# Altium schematic sheet MAZ000154 - Diagrama eléctrico.SchDoc: MAZ000154 - Diagrama eléctrico
size A; ApprovedBy: Christian Ledwidth; CheckedBy: Nahuel Martinez; Author: Santiago Marti; CompanyName: Body Health; DrawnBy: Santiago Marti; Revision: A; SheetNumber: 1; SheetTotal: 2
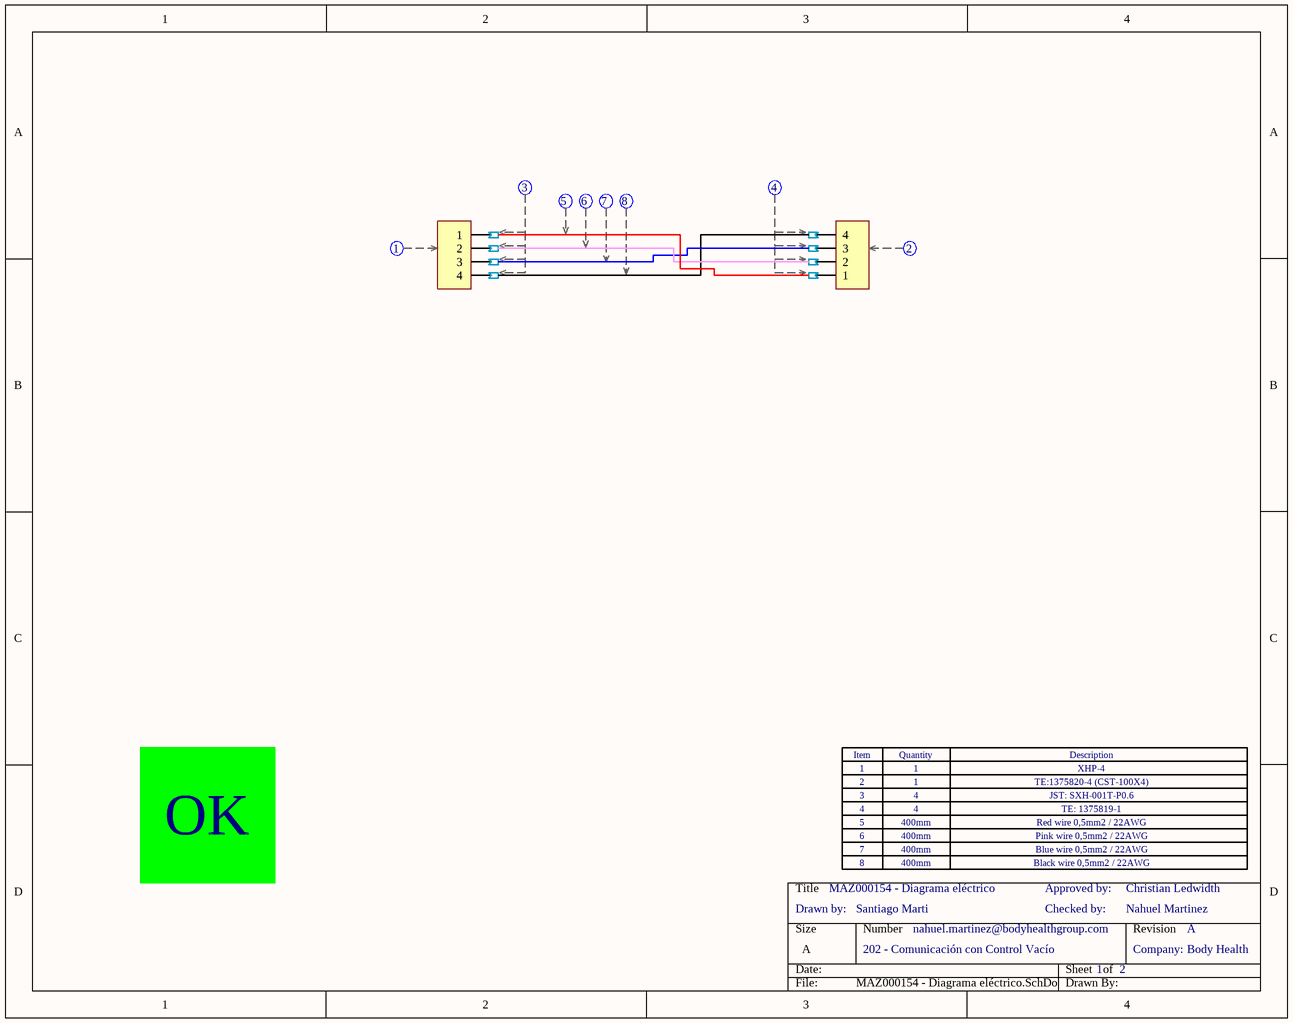
[diagram p0: MAZ000154 - Diagrama eléctrico.SchDoc]

## Parts
(Parts that share a designator on the sheet are numbered #1, #2 ... from top to bottom, then left to right.)
Cab?#1  Cable  (value not drawn)
Cab?#2  Cable  (value not drawn)
Cab?#3  Cable  (value not drawn)
Cab?#4  Cable  (value not drawn)
Con?#1  CST-100-4  (value not drawn)  (part D of 4)
Con?#2  XHP-4  (value not drawn)  (part C of 4)
Con?#3  CST-100-4  (value not drawn)  (part C of 4)
Con?#4  XHP-4  (value not drawn)  (part D of 4)
Soc?#1  sock_XHP_SXH-002T-P0.6  (value not drawn)  (part A of 2)
Soc?#2  sock_CST_1375819-1  (value not drawn)  (part A of 2)
Soc?#3  sock_XHP_SXH-002T-P0.6  (value not drawn)  (part B of 2)
Soc?#4  sock_CST_1375819-1  (value not drawn)  (part B of 2)
Soc?#5  sock_XHP_SXH-002T-P0.6  (value not drawn)  (part B of 2)
Soc?#6  sock_CST_1375819-1  (value not drawn)  (part B of 2)
Soc?#7  sock_XHP_SXH-002T-P0.6  (value not drawn)  (part B of 2)
Soc?#8  sock_CST_1375819-1  (value not drawn)  (part B of 2)
Soc?#9  sock_XHP_SXH-002T-P0.6  (value not drawn)  (part B of 2)
Soc?#10  sock_CST_1375819-1  (value not drawn)  (part B of 2)
Zoc1  Zócalo_Header  (value not drawn)
Zoc2  Zócalo_Item  (value not drawn)
Zoc3  Zócalo_Item  (value not drawn)
Zoc4  Zócalo_Item  (value not drawn)
Zoc5  Zócalo_Item  (value not drawn)
Zoc6  Zócalo_Item  (value not drawn)
Zoc7  Zócalo_Item  (value not drawn)
Zoc8  Zócalo_Item  (value not drawn)
Zoc9  Zócalo_Item  (value not drawn)

## Nets
NetCon?#1_1: Con?#1.1 Soc?#10.0
NetCon?#1_2: Con?#1.2 Soc?#8.0
NetCon?#1_3: Con?#1.3 Soc?#6.0
NetCon?#1_4: Con?#1.4 Soc?#4.0
NetCon?#4_1: Con?#4.1 Soc?#3.0
NetCon?#4_2: Con?#4.2 Soc?#5.0
NetCon?#4_3: Con?#4.3 Soc?#7.0
NetCon?#4_4: Con?#4.4 Soc?#9.0
NetSoc?#3_1: Soc?#3.1 Soc?#10.1
NetSoc?#4_1: Soc?#4.1 Soc?#9.1
NetSoc?#5_1: Soc?#5.1 Soc?#8.1
NetSoc?#6_1: Soc?#6.1 Soc?#7.1

## Notes on the sheet
- 1
- 2
- XHP-4
- TE:1375820-4 (CST-100X4)
- OK
- 3
- 4
- 5
- 6
- 400mm
- JST: SXH-001T-P0.6
- TE: 1375819-1
- Red wire 0,5mm2 / 22AWG
- Pink wire 0,5mm2 / 22AWG
- Drawn by:
- 7
- 8
- Checked by:
- Approved by:
- Blue wire 0,5mm2 / 22AWG
- Black wire 0,5mm2 / 22AWG
- 202 - Comunicación con Control Vacío
- nahuel.martinez@bodyhealthgroup.com
- Company:
- (in symbol Zócalo_Header) Item; Quantity; Description

## Library data of the parts
Cab?#1 = Cable: CallOut: 5; Largo: *mm; Sección: 0,5mm2; Color: Red
Cab?#2 = Cable: CallOut: 6; Largo: *mm; Sección: 0,5mm2; Color: Pink
Cab?#3 = Cable: CallOut: 7; Largo: *mm; Sección: 0,5mm2; Color: Blue
Cab?#4 = Cable: CallOut: 8; Largo: *mm; Sección: 0,5mm2; Color: Black
Con?#1 = CST-100-4: CONN RCPT HSNG 4POS CST-100 II; Cod.Fabricante: 1375820-4; Fabricante: TE Connectivity AMP Connectors; Cod.DigiKey: A99615-ND; ComponentLink1Description: Manufacturer Link; ComponentLink1URL: https://www.te.com/commerce/DocumentDelivery/DDEController?Action=srchrtrv&DocNm=1375820&DocType=Customer+Drawing&DocLang=English; DIGIKEYx50: 0.18440; CallOut: *; DIGIKEYx100: 0.17120
Con?#2 = XHP-4: CONN HOUSING 2.5MM 4POS; Fabricante: JST Sales America Inc.; CallOut: 1; Cod.DigiKey: 455-2267-ND; Cod.Fabricante: XHP-4; ComponentLink1Description: Manufacturer Link; ComponentLink1URL: http://www.jst-mfg.com/product/pdf/eng/eXH.pdf; DIGIKEYx50: 0.06220; DIGIKEYx100: NO
Con?#3 = CST-100-4: CONN RCPT HSNG 4POS CST-100 II; Cod.Fabricante: 1375820-4; Fabricante: TE Connectivity AMP Connectors; CallOut: 2; Cod.DigiKey: A99615-ND; ComponentLink1Description: Manufacturer Link; ComponentLink1URL: https://www.te.com/commerce/DocumentDelivery/DDEController?Action=srchrtrv&DocNm=1375820&DocType=Customer+Drawing&DocLang=English; DIGIKEYx50: 0.18440; DIGIKEYx100: 0.17120
Con?#4 = XHP-4: CONN HOUSING 2.5MM 4POS; Fabricante: JST Sales America Inc.; Cod.DigiKey: 455-2267-ND; Cod.Fabricante: XHP-4; ComponentLink1Description: Manufacturer Link; ComponentLink1URL: http://www.jst-mfg.com/product/pdf/eng/eXH.pdf; DIGIKEYx50: 0.06220; CallOut: *; DIGIKEYx100: NO
Soc?#1 = sock_XHP_SXH-002T-P0.6: CONN SOCKET 26-30AWG CRIMP TIN; Fabricante: JST Sales America Inc.; CallOut: 3; Cod.DigiKey: 455-2261-1-ND; Cod.Fabricante: SXH-002T-P0.6; ComponentLink1Description: Manufacturer Link; ComponentLink1URL: http://www.jst-mfg.com/product/pdf/eng/eXH.pdf; DIGIKEYx100: 0.03300; DIGIKEYx50: 0.03420
Soc?#2 = sock_CST_1375819-1: CONN SOCKET 22-26AWG CRIMP TIN; Fabricante: TE Connectivity AMP Connectors; CallOut: 4; Cod.DigiKey: A100453CT-ND; Cod.Fabricante: 1375819-1; ComponentLink1Description: Manufacturer Link; ComponentLink1URL: https://www.te.com/commerce/DocumentDelivery/DDEController?Action=srchrtrv&DocNm=1375819&DocType=Customer+Drawing&DocLang=English; DIGIKEYx100: 0.04210; DIGIKEYx50: 0.03960
Soc?#3 Soc?#5 Soc?#7 Soc?#9 = sock_XHP_SXH-002T-P0.6: CONN SOCKET 26-30AWG CRIMP TIN; Fabricante: JST Sales America Inc.; Cod.DigiKey: 455-2261-1-ND; Cod.Fabricante: SXH-002T-P0.6; ComponentLink1Description: Manufacturer Link; ComponentLink1URL: http://www.jst-mfg.com/product/pdf/eng/eXH.pdf; DIGIKEYx100: 0.03300; CallOut: *; DIGIKEYx50: 0.03420
Soc?#4 Soc?#6 Soc?#8 Soc?#10 = sock_CST_1375819-1: CONN SOCKET 22-26AWG CRIMP TIN; Fabricante: TE Connectivity AMP Connectors; Cod.DigiKey: A100453CT-ND; Cod.Fabricante: 1375819-1; ComponentLink1Description: Manufacturer Link; ComponentLink1URL: https://www.te.com/commerce/DocumentDelivery/DDEController?Action=srchrtrv&DocNm=1375819&DocType=Customer+Drawing&DocLang=English; DIGIKEYx100: 0.04210; CallOut: *; DIGIKEYx50: 0.03960
Zoc1 = Zócalo_Header: Header para el zócalo de referencias
Zoc2-Zoc9 = Zócalo_Item: Ítem para el zócalo de referencias; Desginator: *; Quantity: *; ItemDescription: *